# EAGLE design PlatineOben (EAGLE 9.3.0)
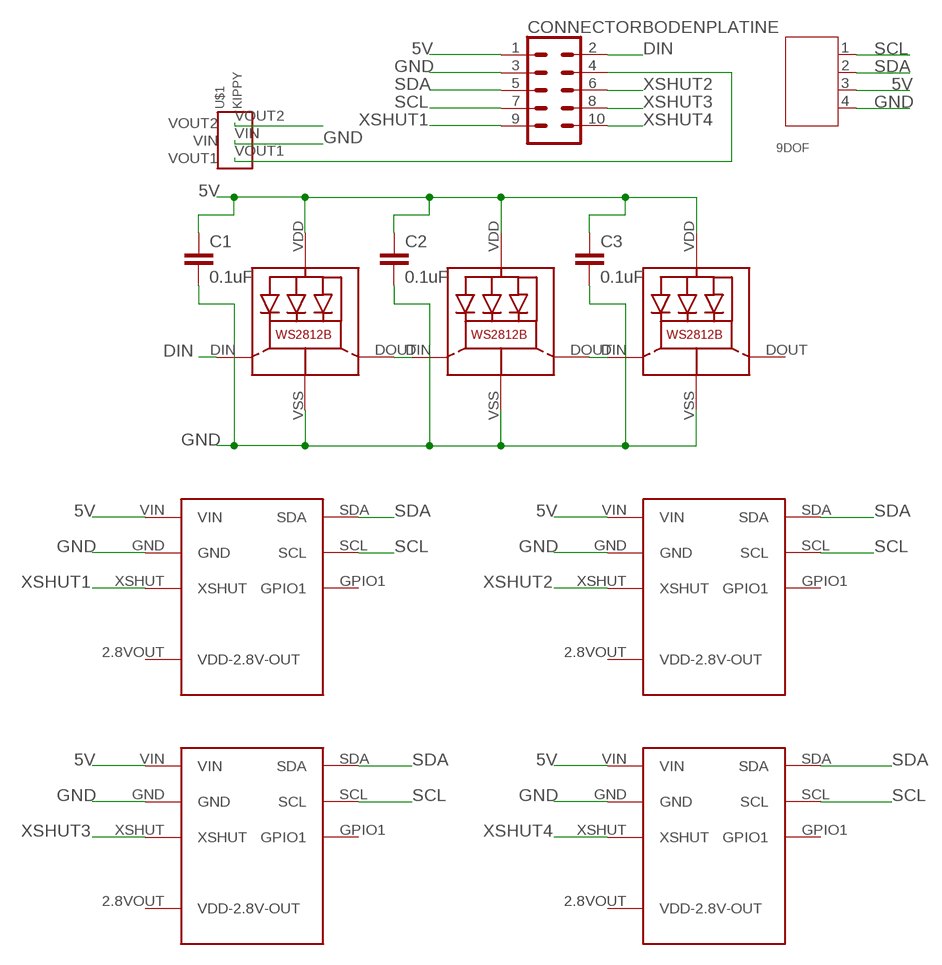
[diagram p0: schematic, sheet 1]

## Parts
9DOF  4P-2.0  JST-PH4  [JST-PH4]
C1  0.1uF  C-EUC0805  [C0805]
C2  0.1uF  C-EUC0805  [C0805]
C3  0.1uF  C-EUC0805  [C0805]
CONNECTORBODENPLATINE  CONN_05X2  [2X5-SHROUDED(3D)]
LED1  WS2812B  [WS2812B]
LED2  WS2812B  [WS2812B]
LED3  WS2812B  [WS2812B]
TOFH  TOFPOLOLUSTEHEND  [TOFPOLOLU_STEHEND]
TOFL  TOFPOLOLUSTEHEND  [TOFPOLOLU_STEHEND]
TOFR  TOFPOLOLUSTEHEND  [TOFPOLOLU_STEHEND]
TOFV  TOFPOLOLUSTEHEND  [TOFPOLOLU_STEHEND]
U$1  KIPPY  [KIPPY]

## Nets
5V [data1A]: 9DOF.3 C1.1 C2.1 C3.1 CONNECTORBODENPLATINE.1 LED1.VDD LED2.VDD LED3.VDD TOFH.VIN TOFL.VIN TOFR.VIN TOFV.VIN
DIN [data1A]: CONNECTORBODENPLATINE.2 LED1.DIN(DI)
GND [data1A]: 9DOF.4 C1.2 C2.2 C3.2 CONNECTORBODENPLATINE.3 LED1.VSS(GND) LED2.VSS(GND) LED3.VSS(GND) TOFH.GND TOFL.GND TOFR.GND TOFV.GND U$1.VIN
N$1: U$1.VOUT2
N$3 [data1A]: CONNECTORBODENPLATINE.4 U$1.VOUT1
N$4 [data1A]: LED1.DOUT(DO) LED2.DIN(DI)
N$5 [data1A]: LED2.DOUT(DO) LED3.DIN(DI)
SCL [data1A]: 9DOF.1 CONNECTORBODENPLATINE.7 TOFH.SCL TOFL.SCL TOFR.SCL TOFV.SCL
SDA [data1A]: 9DOF.2 CONNECTORBODENPLATINE.5 TOFH.SDA TOFL.SDA TOFR.SDA TOFV.SDA
XSHUT1 [data1A]: CONNECTORBODENPLATINE.9 TOFR.XSHUT
XSHUT2 [data1A]: CONNECTORBODENPLATINE.6 TOFL.XSHUT
XSHUT3 [data1A]: CONNECTORBODENPLATINE.8 TOFV.XSHUT
XSHUT4 [data1A]: CONNECTORBODENPLATINE.10 TOFH.XSHUT
Unconnected: LED3.DOUT(DO) TOFH.2.8VOUT(VDD-2.8V-OUT) TOFH.GPIO1 TOFL.2.8VOUT(VDD-2.8V-OUT) TOFL.GPIO1 TOFR.2.8VOUT(VDD-2.8V-OUT) TOFR.GPIO1 TOFV.2.8VOUT(VDD-2.8V-OUT) TOFV.GPIO1

## Library data of the parts
9DOF = BörningComponents:JST-PH4
C1-C3 = resistor:C-EU: CAPACITOR, European symbol
CONNECTORBODENPLATINE = BörningComponents:CONN_05X2: Multi connection point. Often used as Generic Header-pin footprint for 0.1 inch spaced/style header connections For AVR SPI programming port, see special device with nice symbol: "AVR_SPI_PROG_5x2.dev" You can populate with any combo of single row headers, but if you'd like an exact match, check these: 2x5 AVR ICSP Male Header <https://www.sparkfun.com/products/778> (PRT-00778) 2x5 Pin Shrouded Header <https://www.sparkfun.com/products/8506> (PRT-08506) On any of the 0.1 inch spaced packages, you can populate with these: Break Away Headers - Straight <https://www.sparkfun.com/products/116> (PRT-00116) Break Away Male Headers - Right Angle <https://www.sparkfun.com/products/553> (PRT-00553) Female Headers <https://www.sparkfun.com/products/115> (PRT-00115) Break Away Headers - Machine Pin <https://www.sparkfun.com/products/117> (PRT-00117) Break Away Female Headers - Swiss Machine Pin <https://www.sparkfun.com/products/743> (PRT-00743) Special note: the shrouded connector mates well with our 5x2 ribbon cables: 2x5 Pin IDC Ribbon Cable <https://www.sparkfun.com/products/8535> (PRT-08535)
LED1-LED3 = BörningComponents:WS2812B: Features and Benefits  * Intelligent reverse connect protection, the power supply reverse connection does not damage the IC. * The control circuit and the LED share the only power source. Control circuit and RGB chip are integrated in a package of 5050 components, form a complete control of pixel point.  * Built-in signal reshaping circuit, after wave reshaping to the next driver, ensure wave-form distortion not accumulate.  * Built-in electric reset circuit and power lost reset circuit.  * Each pixel of the three primary color can achieve 256 brightness display, completed 16777216 color full color display, and scan frequency not less than 400Hz/s.  * Cascading port transmission signal by single line.  * Any two point the distance more than 5m transmission signal without any increase circuit.  * When the refresh rate is 30fps, cascade number are not less than1024 points.  * Send data at speeds of 800Kbps.  *The color of the light were highly consistent, cost-effective. Applications  Full-color module, Full color soft lights a lamp strip. LED decorative lighting, Indoor/outdoor LED video irregular screen. General description WS2812B is a intelligent control LED light source that the control circuit and RGB chip are integrated in a package of 5050 components. It internal include intelligent digital port data latch and signal reshaping amplification drive circuit. Also include a precision internal oscillator and a 12V voltage programmable constant curre-nt control part, effectively ensuring the pixel point light color height consistent. The data transfer protocol use single NZR communication mode. After the pixel power-on reset, the DIN port receive data from controller, the first pixel collect initial 24bit data then sent to the internal data latch, the other data which reshaping by the internal signal reshaping amplification circuit sent to the next cascade pixel through the DO port. After transmission for each pixel,the signal to reduce 24bit. pixel adopt auto reshaping transmit technology, making the pixel cascade number is not limited the signal transmission, only depend on the speed of signal transmission. LED with low driving voltage, environmental protection and energy saving, high brightness, scattering angle is large, good consistency, low power, long life and other advantages. The control chip integrated in LED above becoming more simple circuit, small volume, convenient installation. Absolute Maximum Ratings Power supply voltage: VDD +3.5V..+5.3V Input voltage: VI -0.5V..VDD+0.5V based on WS2812 from https://github.com/adafruit/Adafruit-Eagle-Library
TOFH TOFL TOFR TOFV = BörningComponents:TOFPOLOLU
U$1 = BörningComponents:KIPPY

## Net classes
1 data1A: width 0.3 mm, drill 0.3 mm, clearance 0.1 mm

## Board
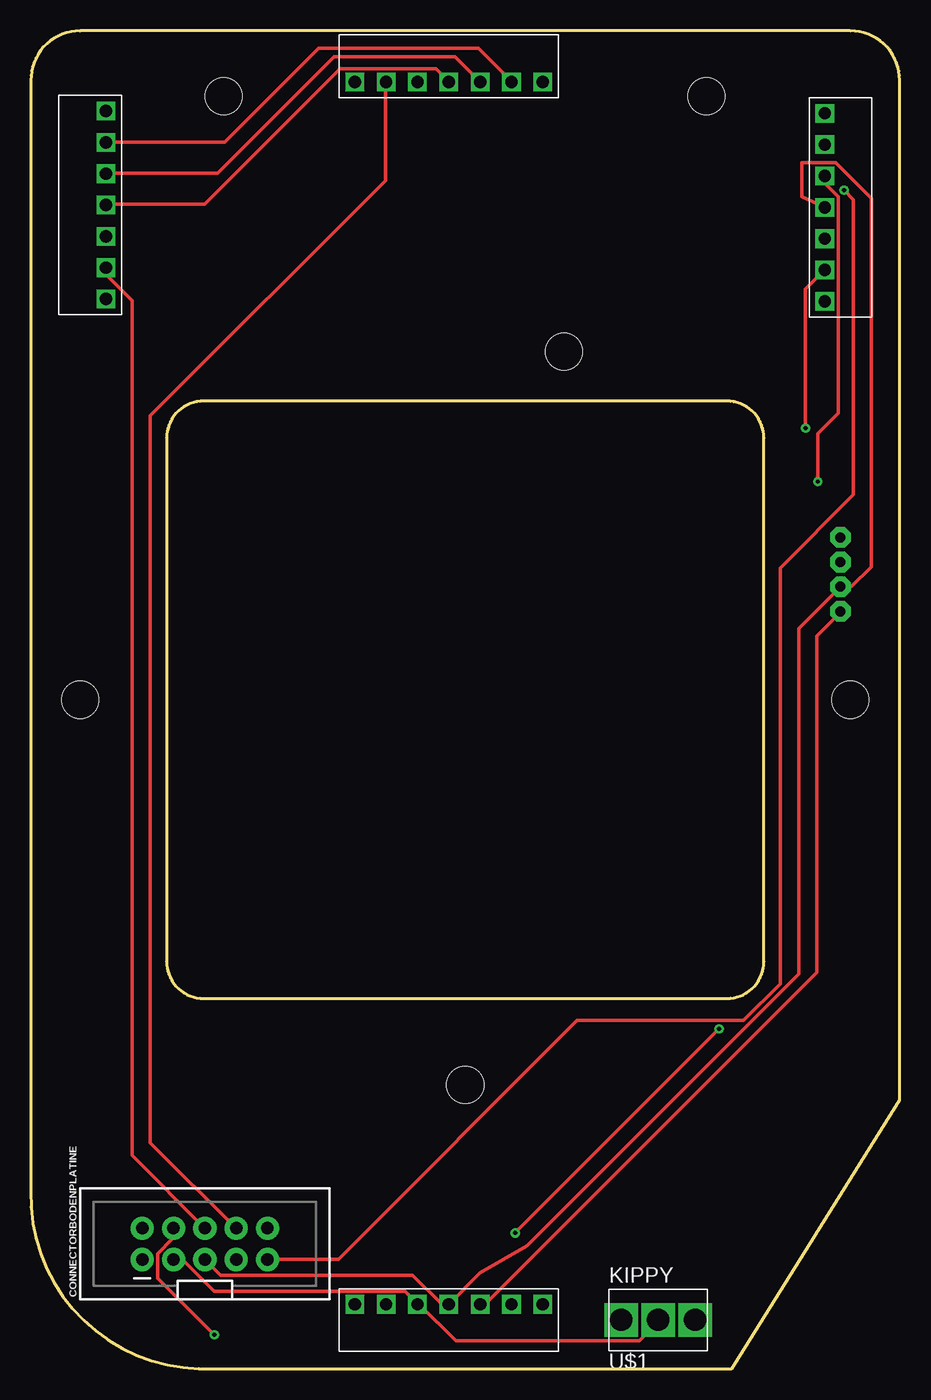
[diagram p1: board, top side]
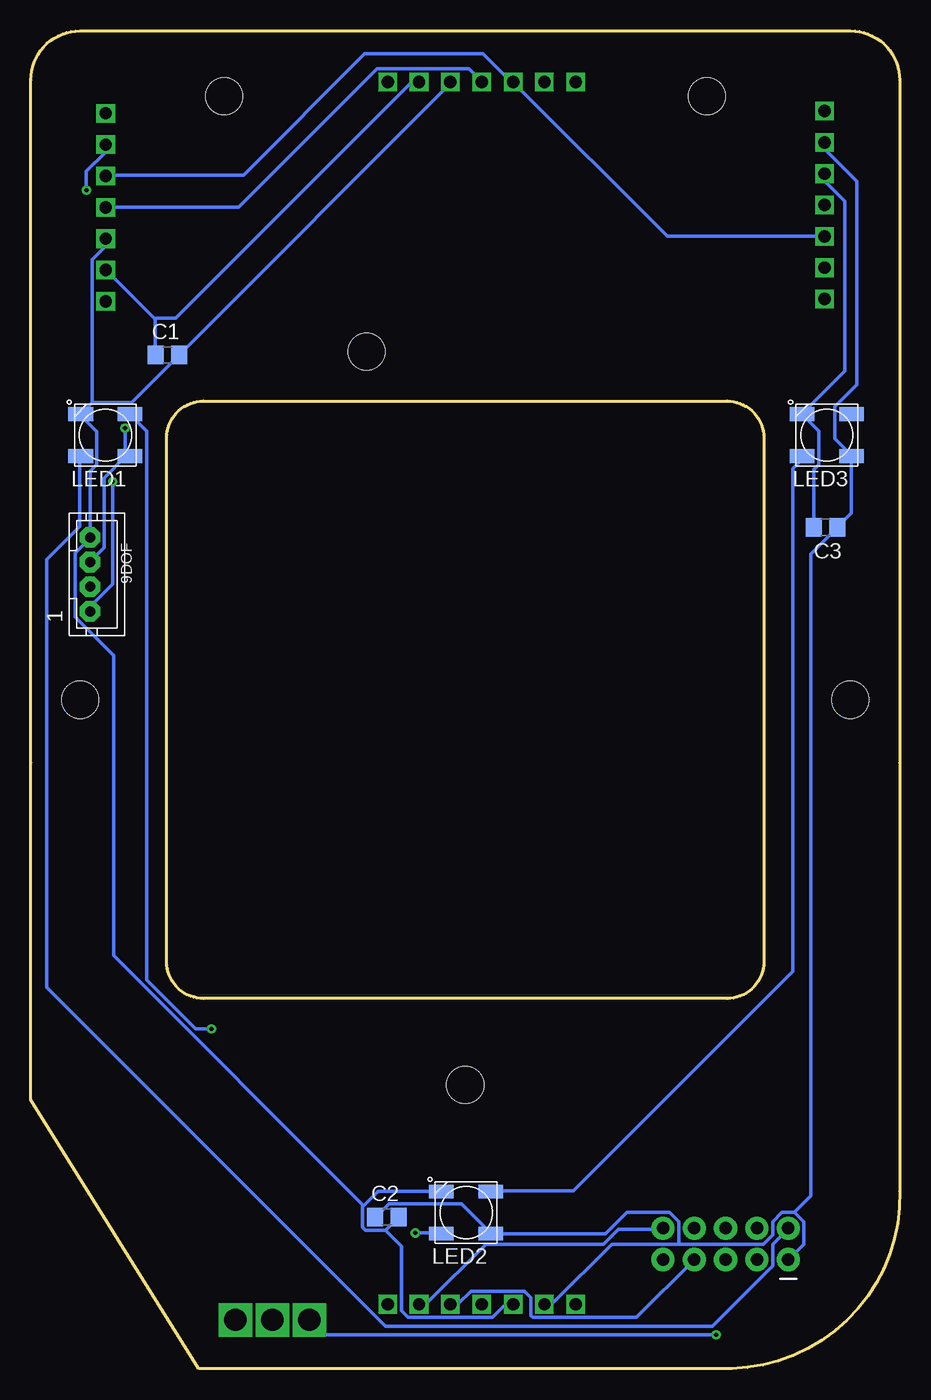
[diagram p2: board, bottom side, seen from below]

Size 70.43 x 108.42 mm. Coordinates in mm from the lower left corner, seen from the top.
Outline: 70.43,49.1 70.43,104.42 arc90 66.43,108.42 4,108.42 arc90 0,104.42 0,49.1 0.01,14.38 arc90 13.62,0 56.81,0 70.42,21.78 70.43,49.1
Outline: 59.43,75.42 arc90 56.43,78.42 14,78.42 arc90 11,75.42 11,32.99 arc90 14,29.99 56.43,29.99 arc90 59.43,32.99 59.43,75.42
Copper layers (1*16): Top 0.035mm / dielectric 2mm / Bottom 0.035mm
Design rules "default *": minimum track width 6mil, minimum drill 0.35mm, track to track 6mil, track to pad 6mil, pad to pad 6mil, via to via 6mil, smd to smd 6mil, copper to edge 40mil, drill to drill 6mil, minimum pad ring 10mil, minimum via ring 8mil, stop-mask expansion 4mil, vias tented up to drill 0.35mm, thermal gap 10mil
Holes 3 mm at 15.63,103.13 35.21,22.99 4,54.21 43.22,82.42 54.76,103.13 66.43,54.21

### Footprints (pad centres in the part's own frame; a part is rotated, then mirrored left to right if it is on the bottom)
JST-PH4 = drill 0.813 pad 1.676 octagon: 1 3,0; 2 1,0; 3 -1,0; 4 -3,0
C0805 = smd 1.3 x 1.5: 1 -0.95,0; 2 0.95,0
2X5-SHROUDED(3D) = drill 1.016 pad 1.88: 1 -1.27,5.08; 2 1.27,5.08; 3 -1.27,2.54; 4 1.27,2.54; 5 -1.27,0; 6 1.27,0; 7 -1.27,-2.54; 8 1.27,-2.54; 9 -1.27,-5.08; 10 1.27,-5.08
WS2812B = smd 2 x 1.1: DIN 2,1.7; DOUT -2,-1.7; VDD -2,1.7; VSS 2,-1.7
TOFPOLOLU_STEHEND = drill 1 square: 2.8VOUT -15.24,0; GND -10.16,0; GPIO1 0,0; SCL -5.08,0; SDA -7.62,0; VIN -12.7,0; XSHUT -2.54,0
KIPPY = drill 1.8 pad 2.5 square: VIN 3,0; VOUT1 0,0; VOUT2 6,0

### Placement (x,y rotation side)
9DOF  65.63,64.37 270 bottom
C1  59.34,82.15 0 bottom
C2  41.56,12.3 0 bottom
C3  6,68.18 180 bottom
CONNECTORBODENPLATINE  14.11,10.11 90 top
LED1  64.39,75.66 180 bottom
LED2  35.15,12.66 180 bottom
LED3  5.91,75.66 180 bottom
TOFH  41.5,5.22 0 top
TOFL  6.08,86.69 270 top
TOFR  64.36,101.74 90 top
TOFV  26.26,104.28 180 top
U$1  47.85,3.95 0 top

### Tracks (layer width: path | path; a pad name or v marks a point on that pad's centre or on a via)
5V  (via drill 0.35)
  Top 0.3: v62.8,76.23 62.8,87.51 64.32,89.03 TOFR.VIN | TOFL.VIN 6.11,99.39 15.71,99.39 23.33,107.02 36.28,107.02 38.95,104.35 TOFV.VIN
  Bottom 0.3: C2.1 42.45,12.3 41.38,13.36 35.52,13.36 33.16,11 LED2.VDD 33,10.93 23.86,10.93 22.11,12.68 18.68,12.68 17.92,11.92 17.92,10.09 | 17.92,10.09 11.06,10.09 10.3,10.85 10.3,11.92 9.53,12.68 8.54,12.68 | 17.92,10.09 23.33,10.09 28.13,5.29 28.74,5.29 TOFH.VIN | 8.54,12.68 7.78,11.92 7.78,10.09 9,8.87 CONNECTORBODENPLATINE.1 | TOFL.VIN 6.03,99.32 6.03,98.78 3.49,96.25 3.49,79.76 5.27,77.98 5.27,75.39 3.97,74.1 LED3.VDD 3.91,69.32 C3.1 7.2,66.03 7.2,14.02 8.54,12.68 | 9DOF.3 65.62,65.41 64.47,66.55 64.47,72.19 62.72,73.94 62.42,73.94 LED1.VDD 62.8,74.02 v62.8,76.23 | 60.36,85.07 60.36,82.17 C1.1 | 60.36,85.07 64.32,89.03 TOFR.VIN | TOFV.VIN 39.02,104.27 39.56,104.27 58.68,85.14 60.28,85.14 60.36,85.07
DIN
  Bottom 0.3: LED1.DIN 66.45,73.94 66.45,68.23 69.12,65.56 69.12,30.89 41.66,3.43 15.2,3.43 10.3,8.34 10.3,10.09 9.08,11.31 CONNECTORBODENPLATINE.2
GND
  Top 0.3: CONNECTORBODENPLATINE.3 11.59,8.79 12.35,8.79 14.87,6.28 30.34,6.28 31.33,5.29 TOFH.GND 31.48,5.21 34.45,2.24 49.31,2.24 50.83,3.76 50.83,3.92 U$1.VIN | TOFL.GND 6.11,96.88 15.15,96.88 24.57,106.3 34.4,106.3 36.36,104.35 TOFV.GND
  Bottom 0.3: 41.69,11.23 C2.2 | 41.69,11.23 43.29,11.23 43.52,11.46 43.52,13.14 43.44,13.21 | 43.44,13.21 42.3,14.35 37.19,14.35 LED2.VSS | 41.69,11.23 40.4,9.94 40.4,4.68 39.86,4.14 33,4.14 31.94,5.21 31.4,5.21 TOFH.GND | TOFL.GND 6.03,96.8 6.03,96.19 4.45,94.62 4.45,80.85 7.86,77.45 LED3.VSS 7.86,77.3 6.56,76 6.56,73.26 6.95,72.87 C3.2 | 65.46,78.29 62.26,78.29 58.45,82.1 C1.2 58.3,82.25 36.43,104.12 TOFV.GND | 65.46,78.29 66.38,77.37 LED1.VSS 66.38,77.22 65.08,75.92 65.08,73.26 65.62,72.72 65.62,67.39 9DOF.4 65.69,67.24 66.84,66.09 66.84,60.91 63.71,57.79 63.71,33.48 43.44,13.21 | 65.46,78.29 65.46,89.87 64.4,90.94 64.4,91.55 TOFR.GND
N$3  (via drill 0.35)
  Top 0.3: v14.87,2.75 10.3,7.32 10.3,9.33 11.52,10.55 11.52,11.31 CONNECTORBODENPLATINE.4
  Bottom 0.3: v14.87,2.75 46.62,2.75 47.79,3.92 U$1.VOUT1
N$4  (via drill 0.35)
  Top 0.3: v55.79,27.54 v39.25,11
  Bottom 0.3: v39.25,11 37.19,11 LED2.DIN | v55.79,27.54 57.08,27.54 61.05,31.5 61.05,76 62.34,77.3 LED1.DOUT
N$5
  Bottom 0.3: LED3.DIN 7.91,73.71 8.67,72.94 8.67,32.21 26.45,14.43 33.08,14.43 LED2.DOUT
SCL  (via drill 0.35)
  Top 0.3: v63.79,71.89 63.79,75.77 65.46,77.45 65.46,94.97 64.4,96.04 64.4,96.65 TOFR.SCL | TOFH.SCL 36.43,5.29 36.89,5.29 63.71,32.11 63.71,59.39 65.62,61.3 9DOF.1
  Bottom 0.3: TOFH.SCL 36.36,5.29 35.75,5.29 34.76,6.28 30.41,6.28 29.88,5.74 29.88,4.3 29.73,4.14 21.34,4.14 16.7,8.79 CONNECTORBODENPLATINE.7 | TOFL.SCL 6.11,91.78 18.83,91.78 TOFV.SCL 31.48,104.27 33.77,106.56 43.37,106.56 53.2,96.73 64.32,96.73 TOFR.SCL | v63.79,71.89 63.79,63.58 65.62,61.75 9DOF.1
SDA
  Top 0.3: CONNECTORBODENPLATINE.5 14.18,8.79 15.4,7.57 30.95,7.57 33.23,5.29 33.84,5.29 TOFH.SDA 36.42,7.77 40.2,9.97 62.24,32.01 62.24,59.97 65.54,63.28 9DOF.2 66.52,63.37 68.11,64.95 68.11,94.85 65.24,97.72 62.49,97.72 62.49,94.98 TOFR.SDA | TOFL.SDA 6.11,94.36 14.08,94.36 25.05,105.34 32.85,105.34 33.84,104.35 TOFV.SDA
  Bottom 0.3: TOFR.SDA 64.32,94.14 53.58,94.14 42.38,105.34 34.91,105.34 33.92,104.35 TOFV.SDA
XSHUT1  (via drill 0.35)
  Top 0.3: v65.92,95.51 66.68,94.75 66.68,70.82 60.74,64.88 60.74,31.2 57.77,28.22 44.28,28.22 24.93,8.87 19.21,8.87 CONNECTORBODENPLATINE.9
  Bottom 0.3: v65.92,95.51 65.92,97.03 64.4,98.56 64.4,99.17 TOFR.XSHUT
XSHUT2
  Top 0.3: TOFL.XSHUT 6.11,89.18 6.11,88.65 8.21,86.54 8.21,17.28 CONNECTORBODENPLATINE.6
XSHUT3
  Top 0.3: TOFV.XSHUT 28.74,104.27 28.74,96.27 9.69,77.22 9.69,18.32 16.62,11.38 CONNECTORBODENPLATINE.8
XSHUT4
  Bottom 0.3: TOFH.XSHUT 38.95,5.29 38.34,5.29 33.54,10.09 24.01,10.09 22.79,11.31 19.21,11.31 CONNECTORBODENPLATINE.10